# EAGLE design RadioMusic_F rev2-2 (EAGLE 9.0.1)
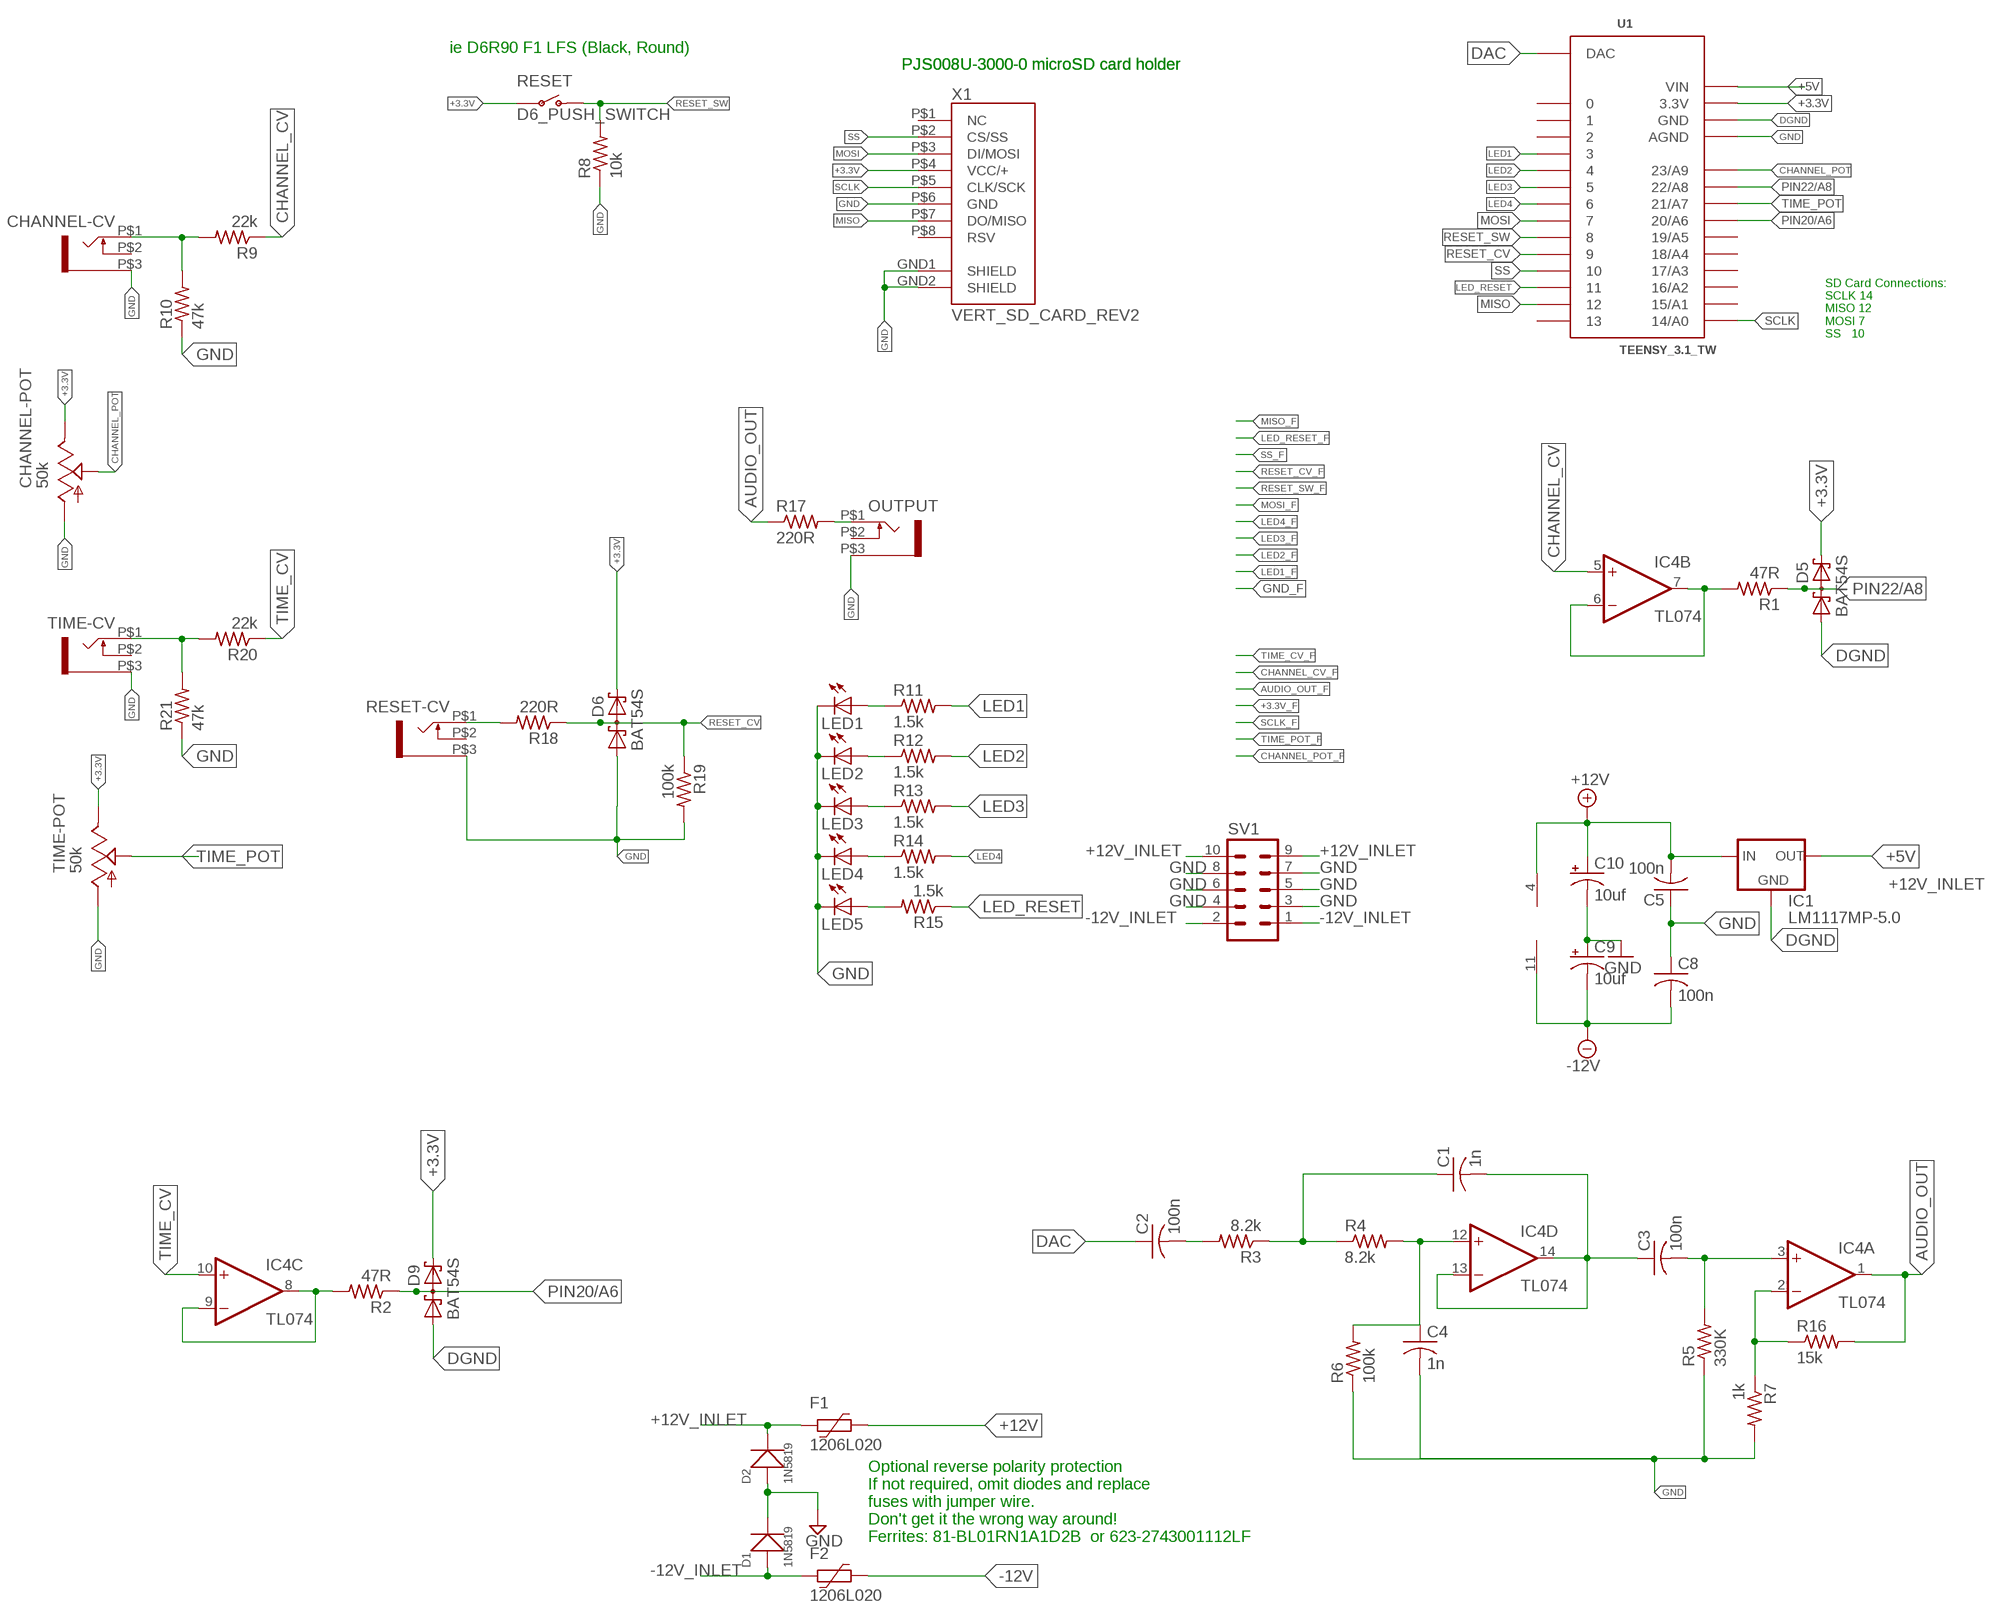
[diagram p0: schematic, sheet 1]

## Parts
C1  1n  C-USC0805  [C0805]
C2  100n  C-USC0805  [C0805]
C3  100n  C-USC0805  [C0805]
C4  1n  C-USC0805  [C0805]
C5  100n  C-USC0805  [C0805]
C8  100n  C-USC0805  [C0805]
C9  10uf  CPOL-USB  [PANASONIC_B]
C10  10uf  CPOL-USB  [PANASONIC_B]
CHANNEL-CV  WQP-PJ301M-12_JACK  [WQP-PJ301M-12_JACK]
CHANNEL-POT  50k  ALPHA-9MMF2A  [EVUF]
D1  1N5819  SMD-DIODE-SCHOTTKY-40V-500MA(SOD-123)  [SOD-123]
D2  1N5819  SMD-DIODE-SCHOTTKY-40V-500MA(SOD-123)  [SOD-123]
D5  BAT54S  [SOT23]
D6  BAT54S  [SOT23]
D9  BAT54S  [SOT23]
F1  1206L020  [1206L]
F2  1206L020  [1206L]
IC1  LM1117MP-5.0  [SOT223]
IC4  TL074  TL074D  [SO14]
LED1  LED3MM  [LED3MM]
LED2  LED3MM  [LED3MM]
LED3  LED3MM  [LED3MM]
LED4  LED3MM  [LED3MM]
LED5  LED3MM  [LED3MM]
OUTPUT  WQP-PJ301M-12_JACK  [WQP-PJ301M-12_JACK]
R1  47R  R-US_R0805  [R0805]
R2  47R  R-US_R0805  [R0805]
R3  8.2k  R-US_R0805  [R0805]
R4  8.2k  R-US_R0805  [R0805]
R5  330K  R-US_R0805  [R0805]
R6  100k  R-US_R0805  [R0805]
R7  1k  R-US_R0805  [R0805]
R8  10k  R-US_R0805  [R0805]
R9  22k  R-US_R0805  [R0805]
R10  47k  R-US_R0805  [R0805]
R11  1.5k  R-US_R0805  [R0805]
R12  1.5k  R-US_R0805  [R0805]
R13  1.5k  R-US_R0805  [R0805]
R14  1.5k  R-US_R0805  [R0805]
R15  1.5k  R-US_R0805  [R0805]
R16  15k  R-US_R0805  [R0805]
R17  220R  R-US_R0805  [R0805]
R18  220R  R-US_R0805  [R0805]
R19  100k  R-US_R0805  [R0805]
R20  22k  R-US_R0805  [R0805]
R21  47k  R-US_R0805  [R0805]
RESET  D6_PUSH_SWITCH  [D6_BUTTON_RND]
RESET-CV  WQP-PJ301M-12_JACK  [WQP-PJ301M-12_JACK]
SV1  10_PIN_HEADER  [MA05-2]
TIME-CV  WQP-PJ301M-12_JACK  [WQP-PJ301M-12_JACK]
TIME-POT  50k  ALPHA-9MMF2A  [EVUF]
U1  TEENSY_3.1_TW  [TEENSY_3.1_TW]
X1  VERT_SD_CARD_REV2  [VERT_MICROSD_REV2]

## Nets
+3.3V: CHANNEL-POT.3(E) D5.2(C2) D6.2(C2) D9.2(C2) RESET.P$3(P) RESET.P$4(P) TIME-POT.3(E) U1.3.3V X1.P$4(VCC/+)
+5V: IC1.2(OUT) IC1.4(OUT) U1.VIN
+12V [power]: C5.2 C10.+ F1.1 IC1.3(IN) IC4.4(P:V+)
+12V_INLET [power]: D2.- F1.2 SV1.9 SV1.10
-12V [power]: C8.2 C9.- F2.1 IC4.11(P:V-)
-12V_INLET [power]: D1.+ F2.2 SV1.1 SV1.2
AUDIO_OUT: IC4.1(A:OUT) R16.2 R17.1
CHANNEL_CV: IC4.5(B:+IN) R9.1
CHANNEL_POT: CHANNEL-POT.2(S) U1.23/A9
DAC: C2.1 U1.DAC
DGND: D5.1(A1) D9.1(A1) IC1.1(GND) U1.GND
GND [ground]: C4.2 C5.1 C8.1 C9.+ C10.- CHANNEL-CV.P$3 CHANNEL-POT.1(A) D1.- D2.+ D6.1(A1) LED1.K(C) LED2.K(C) LED3.K(C) LED4.K(C) LED5.K(C) OUTPUT.P$3 R5.1 R6.1 R7.2 R8.1 R10.1 R19.2 R21.1 RESET-CV.P$3 SV1.3 SV1.4 SV1.5 SV1.6 SV1.7 SV1.8 TIME-CV.P$3 TIME-POT.1(A) U1.AGND X1.GND1(SHIELD) X1.GND2(SHIELD) X1.P$6(GND)
LED1: R11.2 U1.3
LED2: R12.2 U1.4
LED3: R13.2 U1.5
LED4: R14.2 U1.6
LED_RESET: R15.1 U1.11
MISO: U1.12 X1.P$7(DO/MISO)
MOSI: U1.7 X1.P$3(DI/MOSI)
N$1: IC4.6(B:-IN) IC4.7(B:OUT) R1.2
N$2: C4.1 IC4.12(D:+IN) R4.2 R6.2
N$3: OUTPUT.P$1 R17.2
N$4: C1.1 R3.1 R4.1
N$5: C1.2 C3.1 IC4.13(D:-IN) IC4.14(D:OUT)
N$6: C3.2 IC4.3(A:+IN) R5.2
N$7: IC4.2(A:-IN) R7.1 R16.1
N$8: IC4.8(C:OUT) IC4.9(C:-IN) R2.2
N$9: CHANNEL-CV.P$1 R9.2 R10.2
N$10: C2.2 R3.2
N$11: LED2.A R12.1
N$12: LED4.A R14.1
N$13: LED3.A R13.1
N$14: R18.2 RESET-CV.P$1
N$15: LED1.A R11.1
N$16: LED5.A R15.2
PIN20/A6: D9.3(C1A2) R2.1 U1.20/A6
PIN22/A8: D5.3(C1A2) R1.1 U1.22/A8
RESET_CV: D6.3(C1A2) R18.1 R19.1 U1.9
RESET_SW: R8.2 RESET.P$1(O) RESET.P$2(O) U1.8
SCLK: U1.14/A0 X1.P$5(CLK/SCK)
SS: U1.10 X1.P$2(CS/SS)
TEMP: R20.2 R21.2 TIME-CV.P$1
TIME_CV: IC4.10(C:+IN) R20.1
TIME_POT: TIME-POT.2(S) U1.21/A7
Unconnected: CHANNEL-CV.P$2 OUTPUT.P$2 RESET-CV.P$2 TIME-CV.P$2 U1.0 U1.1 U1.2 U1.13 U1.15/A1 U1.16/A2 U1.17/A3 U1.18/A4 U1.19/A5 X1.P$1(NC) X1.P$8(RSV)

## Notes on the sheet
- ie D6R90 F1 LFS (Black, Round)
- PJS008U-3000-0 microSD card holder | PJS008U-3000-0 microSD card holder
- SD Card Connections: 
   SCLK 14
   MISO 12
   MOSI 7 
   SS   10
- Optional reverse polarity protection
  If not required, omit diodes and replace
  fuses with jumper wire. 
  Don't get it the wrong way around! 
  Ferrites: 81-BL01RN1A1D2B  or 623-2743001112LF

## Library data of the parts
C1-C5 C8 = rcl:C-US: CAPACITOR, American symbol; SPICEPREFIX: C
C9 C10 = resistor:CPOL-US: POLARIZED CAPACITOR, American symbol
CHANNEL-CV OUTPUT RESET-CV TIME-CV = thonkiconn:WQP-PJ301M-12_JACK
CHANNEL-POT TIME-POT = TomW:ALPHA-9MM: 9 mm Square Rotary Potentiometers Source: Panasonic
D1 D2 = Seeed-Diode:SMD-DIODE-SCHOTTKY-40V-500MA(SOD-123): 304020012; MPN: B0540W; VALUE: 40V-500MA
D5 D6 D9 = diode:BAT54S: Schottky Diodes Pin connection corrected 2011-05-04 Source: Fairchild .. BAT54.pdf
F1 F2 = polyfuse-smd_10:?: Polyfuse Resettable PTC Source: http://www.littelfuse.com/products/resettable-ptcs.aspx; MF: Littelfuse; MPN: 1206L020; OC_FARNELL: 2072173; OC_NEWARK: 05M2300
IC1 = lm1117:LM1117?-*: 800mA Low-Dropout Linear Regulator Source: http://ww1.microchip.com/downloads/en/DeviceDoc/39760d.pdf; MF: Texas Instruments; MPN: LM1117MP-5.0; OC_FARNELL: 9778209; OC_NEWARK: 28X3417
IC4 = linear:TL074: OP AMP
LED1-LED5 = TomW:LED: LED OSRAM: - CHIPLED LG R971, LG N971, LY N971, LG Q971, LY Q971, LO R971, LY R971 LH N974, LH R974 LS Q976, LO Q976, LY Q976 LO Q996 - Hyper CHIPLED LW Q18S LB Q993, LB Q99A, LB R99A - SideLED LS A670, LO A670, LY A670, LG A670, LP A670 LB A673, LV A673, LT A673, LW A673 LH A674 LY A675 LS A676, LA A676, LO A676, LY A676, LW A676 LS A679, LY A679, LG A679 - Hyper Micro SIDELED® LS Y876, LA Y876, LO Y876, LY Y876 LT Y87S - SmartLED LW L88C, LW L88S LB L89C, LB L89S, LG L890 LS L89K, LO L89K, LY L89K LS L896, LA L896, LO L896, LY L896 - TOPLED LS T670, LO T670, LY T670, LG T670, LP T670 LSG T670, LSP T670, LSY T670, LOP T670, LYG T670 LG T671, LOG T671, LSG T671 LB T673, LV T673, LT T673, LW T673 LH T674 LS T676, LA T676, LO T676, LY T676, LB T676, LH T676, LSB T676, LW T676 LB T67C, LV T67C, LT T67C, LS T67K, LO T67K, LY T67K, LW E67C LS E67B, LA E67B, LO E67B, LY E67B, LB E67C, LV E67C, LT E67C LW T67C LS T679, LY T679, LG T679 LS T770, LO T770, LY T770, LG T770, LP T770 LB T773, LV T773, LT T773, LW T773 LH T774 LS E675, LA E675, LY E675, LS T675 LS T776, LA T776, LO T776, LY T776, LB T776 LHGB T686 LT T68C, LB T68C - Hyper Mini TOPLED® LB M676 - Mini TOPLED Santana® LG M470 LS M47K, LO M47K, LY M47K Source: http://www.osram.convergy.de LUXEON: - LUMILED® LXK2-PW12-R00, LXK2-PW12-S00, LXK2-PW14-U00, LXK2-PW14-V00 LXK2-PM12-R00, LXK2-PM12-S00, LXK2-PM14-U00 LXK2-PE12-Q00, LXK2-PE12-R00, LXK2-PE12-S00, LXK2-PE14-T00, LXK2-PE14-U00 LXK2-PB12-K00, LXK2-PB12-L00, LXK2-PB12-M00, LXK2-PB14-N00, LXK2-PB14-P00, LXK2-PB14-Q00 LXK2-PR12-L00, LXK2-PR12-M00, LXK2-PR14-Q00, LXK2-PR14-R00 LXK2-PD12-Q00, LXK2-PD12-R00, LXK2-PD12-S00 LXK2-PH12-R00, LXK2-PH12-S00 LXK2-PL12-P00, LXK2-PL12-Q00, LXK2-PL12-R00 Source: www.luxeon.com KINGBRIGHT: KA-3528ASYC Source: www.kingbright.com
R1-R21 = rcl:R-US_: RESISTOR, American symbol; SPICEPREFIX: R
RESET = TomW:D6_PUSH_SWITCH
SV1 = TomW:10_PIN_HEADER: PIN HEADER; OC_FARNELL: unknown; OC_NEWARK: unknown
U1 = TomW:TEENSY_3.1_TW: Basic Teensy 3.0 with none of the 'inner' pins enabled. See '+4', 'AllAnalogPins", and 'AllPins' packages for additional pin holes, as needed.
X1 = TomW:VERT_SD_CARD_REV2

## Net classes
0 default: width 0.203 mm
1 power: width 0.305 mm
2 ground: width 0.305 mm

## Board
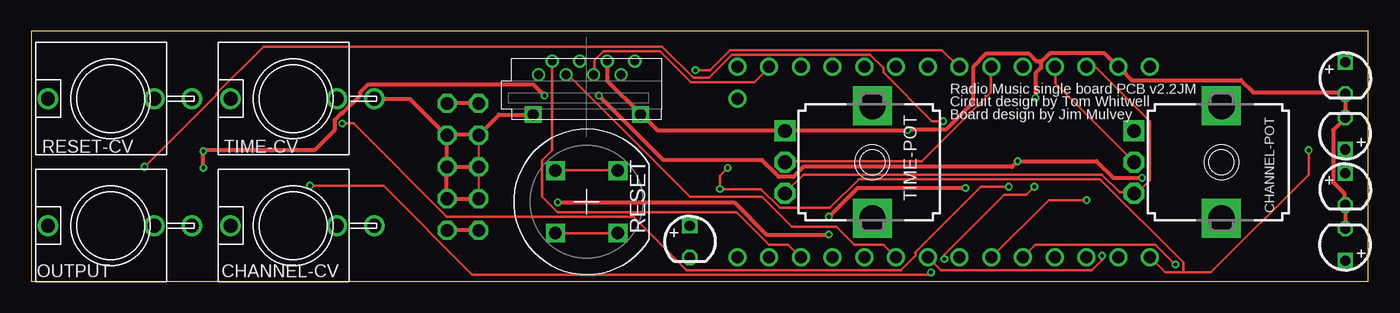
[diagram p1: board, top side]
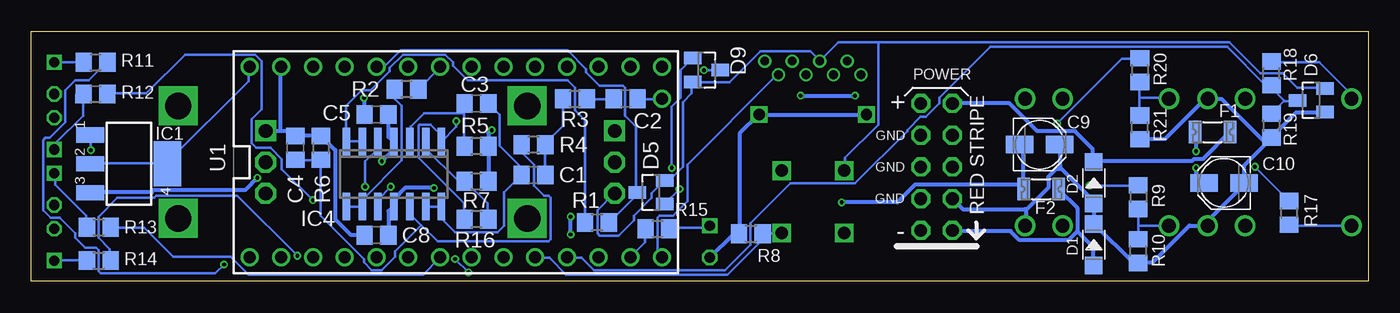
[diagram p2: board, bottom side, seen from below]

Size 107 x 20 mm. Coordinates in mm from the lower left corner, seen from the top.
Outline: 0,20 0,0 107,0 107,20 0,20
Copper layers (1*2*15*16): Top 0.035mm / dielectric 0.2mm / Route2 0.0175mm / dielectric 1.1mm / Route15 0.0175mm / dielectric 0.2mm / Bottom 0.035mm
Design rules "SeeedStudio_DRU_no_angle_20130527": minimum track width 6mil, minimum drill 12mil, track to track 6mil, track to pad 6mil, pad to pad 6mil, via to via 6mil, smd to smd 0mil, copper to edge 10mil, drill to drill 10mil, minimum pad ring 6mil, minimum via ring 6mil, stop-mask expansion 2mil, vias tented up to drill 25mil, thermal gap 10mil

### Footprints (pad centres in the part's own frame; a part is rotated, then mirrored left to right if it is on the bottom)
C0805 = smd 1.3 x 1.5: 1 -0.95,0; 2 0.95,0
PANASONIC_B = smd 2.2 x 1.4: + 1.6,0; - -1.6,0
WQP-PJ301M-12_JACK = drill 1.1: P$1 0,5; P$2 0,-3.5; P$3 0,-6.5
EVUF = drill 1.1 pad 1.676 square: 1 -2.5,-7 | drill 1.1 pad 1.676 octagon: 2 0,-7; 3 2.5,-7 | drill 2.1 pad 2.8 square: M1 4.5,0; M2 -4.5,0
SOD-123 = smd 1.397 x 1.397: + -1.651,0; - 1.651,0
SOT23 = smd 1 x 1.4: 1 -0.95,-1.1; 2 0.95,-1.1; 3 0,1.1
1206L = smd 1 x 1.8: 1 -1.4,0; 2 1.4,0
SOT223 = smd 1.219 x 2.235: 1 -2.311,-3.099; 2 0,-3.099; 3 2.311,-3.099 | smd 3.6 x 2.2: 4 0,3.099
SO14 = smd 0.6 x 2.2: 1 -3.81,-2.6; 2 -2.54,-2.6; 3 -1.27,-2.6; 4 0,-2.6; 5 1.27,-2.6; 6 2.54,-2.6; 7 3.81,-2.6; 8 3.81,2.6; 9 2.54,2.6; 10 1.27,2.6; 11 0,2.6; 12 -1.27,2.6; 13 -2.54,2.6; 14 -3.81,2.6
LED3MM = drill 0.813 square: A -1.27,0 | drill 0.813 octagon: K 1.27,0
R0805 = smd 1.3 x 1.5: 1 -0.95,0; 2 0.95,0
D6_BUTTON_RND = drill 1 square: P$1 -2.5,2.5; P$2 2.5,2.5; P$3 2.5,-2.5; P$4 -2.5,-2.5
MA05-2 = drill 1.016 octagon: 1 -5.08,-1.27; 2 -5.08,1.27; 3 -2.54,-1.27; 4 -2.54,1.27; 5 0,-1.27; 6 0,1.27; 7 2.54,-1.27; 8 2.54,1.27; 9 5.08,-1.27; 10 5.08,1.27
TEENSY_3.1_TW = drill 0.965: 0 -7.62,13.97; 1 -7.62,11.43; 2 -7.62,8.89; 3 -7.62,6.35; 3.3V 7.62,11.43; 4 -7.62,3.81; 5 -7.62,1.27; 6 -7.62,-1.27; 7 -7.62,-3.81; 8 -7.62,-6.35; 9 -7.62,-8.89; 10 -7.62,-11.43; 11 -7.62,-13.97; 12 -7.62,-16.51; 13 7.62,-16.51; 14/A0 7.62,-13.97; 15/A1 7.62,-11.43; 16/A2 7.62,-8.89; 17/A3 7.62,-6.35; 18/A4 7.62,-3.81; 19/A5 7.62,-1.27; 20/A6 7.62,1.27; 21/A7 7.62,3.81; 22/A8 7.62,6.35; 23/A9 7.62,8.89; AGND 7.62,13.97; DAC 5.08,-16.51; GND -7.62,16.51; VIN 7.62,16.51
VERT_MICROSD_REV2 = drill 0.9 square: GND1 -4.3,-3.17; GND2 4.3,-3.17 | drill 0.7: P$1 -3.85,0; P$2 -2.75,1.1; P$3 -1.65,0; P$4 -0.55,1.1; P$5 0.55,0; P$6 1.65,1.1; P$7 2.75,0; P$8 3.85,1.1

### Placement (x,y rotation side)
C1  66.8,8.51 180 bottom
C2  59.44,14.61 180 bottom
C3  71.37,14.22 180 bottom
C4  85.85,10.67 90 bottom
C5  79.38,13.34 0 bottom
C8  79.38,3.68 0 bottom
C9  26.29,10.92 0 bottom
C10  11.56,7.87 180 bottom
CHANNEL-CV  20.95,4.45 90 top
CHANNEL-POT  95.25,9.53 270 top
D1  21.97,2.92 90 bottom
D2  21.97,7.87 90 bottom
D5  57.4,7.11 90 bottom
D6  4.57,14.48 90 bottom
D9  52.96,16.89 270 bottom
F1  12.45,11.94 0 bottom
F2  26.16,7.37 0 bottom
IC1  99.19,9.4 270 bottom
IC4  77.98,8.58 180 bottom
LED1  105.16,16.26 270 top
LED2  105.16,11.81 90 top
LED3  105.16,7.37 270 top
LED4  105.16,2.92 90 top
LED5  52.7,3.17 270 top
OUTPUT  6.35,4.45 90 top
R1  61.72,4.7 180 bottom
R2  76.96,15.37 180 bottom
R3  63.5,14.61 0 bottom
R4  66.8,10.92 180 bottom
R5  71.37,10.79 180 bottom
R6  83.82,10.67 270 bottom
R7  71.37,8 0 bottom
R8  49.4,3.81 0 bottom
R9  18.41,6.73 270 bottom
R10  18.41,2.41 90 bottom
R11  101.85,17.53 0 bottom
R12  101.85,14.99 359.4 bottom
R13  101.6,4.32 0 bottom
R14  101.6,1.65 0 bottom
R15  56.9,4.19 0 bottom
R16  71.37,4.95 180 bottom
R17  6.35,5.46 270 bottom
R18  7.75,16.64 90 bottom
R19  7.75,12.45 270 bottom
R20  18.29,16.89 270 bottom
R21  18.29,12.32 90 bottom
RESET  44.45,6.35 180 top
RESET-CV  6.35,14.61 90 top
SV1  34.54,9.14 90 bottom
TIME-CV  20.95,14.61 90 top
TIME-POT  67.31,9.53 270 top
U1  73.03,9.53 90 bottom
X1  44.45,16.51 0 top

### Tracks (layer width: path | path; a pad name or v marks a point on that pad's centre or on a via)
+3.3V
  Top 0.203: U1.3.3V 84.45,17.07 85.25,17.07 89.52,12.8 89.52,8.09 88.54,7.11 88.28,7.11 CHANNEL-POT.3 88.19,7.11 87.12,7.11 85.7,8.53 61.78,8.53 60.36,7.11 TIME-POT.3 | RESET.P$3 41.96,8.89 46.94,8.89 RESET.P$4
  Bottom 0.203: TIME-POT.3 60.36,7.02 61.7,5.69 61.7,3.82 61.52,3.65 60.01,3.65 58.76,4.89 58.76,5.25 57.34,6.67 57.34,7.02 56.36,8 D5.2 56.27,8.09 55.92,8.09 54.85,9.16 54.85,14.31 54.14,15.02 54.14,15.91 D9.2 53.96,15.91 51.12,15.91 48.63,18.4 44.63,18.4 43.92,17.69 X1.P$4 43.83,17.69 42.41,19.11 39.2,19.11 | 39.2,19.11 11.11,19.11 8.62,16.62 6.84,16.62 5.69,15.47 3.56,15.47 D6.2 | 39.2,19.11 39.2,12.54 41.87,9.87 41.87,8.89 RESET.P$3
+5V
  Bottom 0.203: IC1.2 102.23,9.42 96.1,9.42 IC1.4 96.1,9.51 89.61,16 89.61,17.07 U1.VIN
+12V  (via drill 0.3)
  Top 0.305: v13.78,9.07 v13.78,10.4 13.87,10.49 22.67,10.49 24.27,12.09 24.27,12.89 24.8,13.42 24.89,13.42 26.31,14.85 26.31,15.11 26.94,15.73 40.18,15.73 v41.07,14.85 | v88.9,8.27 86.59,8.27 85.25,9.6 v78.94,9.6 78.5,9.16 61.78,9.16 60.98,8.36 59.83,8.36 58.5,9.69 50.58,9.69 v45.43,14.85
  Bottom 0.305: v13.78,10.4 13.78,11.91 F1.1 | v13.78,9.07 13.78,8.53 13.16,7.91 C10.+ | C5.2 78.41,11.56 78.05,11.2 IC4.4 77.97,11.02 77.97,10.58 v78.94,9.6 | v88.9,8.27 89.88,7.29 97.17,7.29 97.35,7.11 102.23,7.11 IC1.3 | v45.43,14.85 v41.07,14.85
+12V_INLET
  Top 0.305: SV1.10 SV1.9
  Bottom 0.305: F1.2 11.11,11.91 13.25,9.78 13.96,9.78 14.13,9.6 21.96,9.6 D2.- 22.05,9.69 22.05,10.58 23.47,12 26.49,12 28.71,14.22 SV1.9
-12V  (via drill 0.3)
  Top 0.305: v74.77,7.47 66.14,7.47 v63.83,5.16 | v63.83,3.73 58.85,3.73 56.27,6.31 v42.14,6.31
  Bottom 0.305: C8.2 78.41,3.73 78.41,5.6 78.05,5.96 IC4.11 77.97,6.13 77.97,6.58 77.08,7.47 v74.77,7.47 | C9.- 27.83,10.85 27.65,10.67 27.65,7.38 F2.1 27.74,7.73 36.27,7.73 37.69,6.31 v42.14,6.31 | v63.83,3.73 v63.83,5.16
-12V_INLET
  Top 0.305: SV1.1 33.34,4.09 35.74,4.09 SV1.2
  Bottom 0.305: 23.29,4 22.05,2.76 22.05,1.33 D1.+ | 23.29,4 23.29,5.87 24.71,7.29 F2.2 | 23.29,4 24,3.29 27.91,3.29 28.63,4 33.25,4 SV1.1
AUDIO_OUT  (via drill 0.3)
  Top 0.203: v9.07,9.16 14.85,14.94 14.85,15.02 18.58,18.76 50.49,18.76 52.98,16.27 54.23,16.27 56.1,18.14 67.12,18.14 68.19,17.07 68.19,16.71 72.1,12.8 v72.99,12.8
  Bottom 0.203: v9.07,9.16 6.4,6.49 R17.1 | v72.99,12.8 72.99,12.36 IC4.1 73.97,11.47 75.03,12.54 75.92,12.54 76.01,12.45 76.01,9.87 72.36,6.22 72.36,4.98 R16.2
CHANNEL_CV  (via drill 0.3)
  Top 0.203: v22.31,7.64 28.18,7.64 35.29,0.53 71.83,0.53 v72.01,0.71 | v73.08,1.78 73.08,2.13 77.88,6.93 79.65,6.93 v80.28,7.56
  Bottom 0.203: v22.31,7.64 18.49,7.64 R9.1 | v73.08,1.78 v72.01,0.71 | v80.28,7.56 80.28,9.6 79.3,10.58 79.3,11.11 IC4.5
CHANNEL_POT
  Top 0.203: U1.23/A9 81.97,17.07 81.97,15.82 88.19,9.6 CHANNEL-POT.2
DAC
  Bottom 0.203: C2.1 58.41,14.58 56.54,14.58 U1.DAC
DGND  (via drill 0.3)
  Top 0.203: v55.74,9.07 55.12,8.45 v55.12,7.38 58.41,7.38 59.92,5.87 63.92,5.87 66.23,8.18 85.52,8.18 92.19,1.51 92.19,0.71 | v102.23,10.49 102.23,8.53 94.41,0.71 92.19,0.71 | 92.19,0.71 90.77,0.71 89.61,1.87 U1.GND
  Bottom 0.203: v55.12,7.38 56.27,6.22 D5.1 | v55.74,9.07 55.74,13.96 55.03,14.67 55.03,16.89 54.14,17.78 D9.1 | v102.23,10.49 102.23,11.65 IC1.1
GND  (via drill 0.3)
  Top 0.152: SV1.8 35.81,6.66 35.74,6.58
  Top 0.305: SV1.4 35.74,6.58 33.34,6.58 SV1.3 33.25,6.76 33.25,9.07 SV1.5 | SV1.6 35.74,9.16 33.43,9.16 SV1.5 | X1.GND1 40.09,13.34 37.43,13.34 35.83,11.73 SV1.8 35.74,11.73 33.34,11.73 SV1.7 | TIME-CV.P$3 27.47,14.58 30.32,14.58 33.16,11.73 SV1.7 | SV1.5 33.25,9.25 33.25,11.56 SV1.7 | LED4.K 105.17,4.27 105.17,6.04 LED3.K 105.08,6.22 105.08,7.02 104.19,7.91 104.19,12.09 105.08,12.98 LED2.K 105.17,13.16 105.17,14.94 LED1.K 105.08,15.11 97.79,15.11 96.81,16.09 88.1,16.09 87.12,17.07 U1.AGND 86.94,17.16 85.88,18.22 81.52,18.22 80.81,17.51 | v80.37,14.67 80.37,16.62 80.81,17.07 80.81,17.51 | X1.P$6 46.14,17.6 46.14,16 48.72,13.42 X1.GND2 48.9,13.34 50.14,12.09 60.19,12.09 TIME-POT.1 60.36,12.09 v70.14,12.09 70.23,12.18 73.25,12.18 75.39,14.31 75.39,17.16 76.45,18.22 79.83,18.22 80.45,17.6 80.72,17.6 80.81,17.51
  Bottom 0.305: R21.1 18.22,11.38 16.27,11.38 13.07,14.58 12.89,14.58 RESET-CV.P$3 12.71,14.58 11.73,14.58 8.27,11.11 R19.2 | D6.1 3.56,13.51 5.78,13.51 7.73,11.56 R19.2 | R19.2 7.82,11.38 9.96,9.25 9.96,7.91 C10.- 9.96,7.73 12.8,4.89 12.8,4.45 OUTPUT.P$3 14.31,4.45 17.25,1.51 18.31,1.51 R10.1 18.49,1.51 18.85,1.51 21.87,4.53 D1.- 21.96,4.62 21.96,6.22 D2.+ 21.87,6.31 24.62,9.07 | 24.62,9.07 24.62,10.85 C9.+ | 27.38,5.69 27.38,4.45 CHANNEL-CV.P$3 | 27.38,5.69 25.6,7.47 25.6,8.36 24.98,8.98 24.71,8.98 24.62,9.07 | SV1.3 32.45,5.78 27.47,5.78 27.38,5.69 | v80.37,14.67 80.37,13.34 C5.1 | C8.1 80.37,3.73 81.43,3.73 82.68,4.98 82.68,10.49 83.74,11.56 R6.1 83.92,11.65 85.79,11.65 C4.2 85.97,11.65 86.32,12 87.03,12 | 87.03,12 88.19,12 CHANNEL-POT.1 | 87.03,12 87.03,17.07 U1.AGND | R7.2 70.41,10.76 R5.1 70.41,10.94 70.41,11.82 v70.14,12.09 | LED5.K 52.63,1.96 50.85,3.73 50.41,3.73 R8.1 50.32,3.91 50.32,11.82 48.81,13.34 X1.GND2 48.63,13.34 40.18,13.34 X1.GND1
LED1  (via drill 0.3)
  Top 0.203: v91.57,1.33 89.97,2.93 80.37,2.93 79.39,1.96 U1.3
  Bottom 0.203: v91.57,1.33 92.28,0.62 101.44,0.62 101.61,0.8 101.61,2.49 101.79,2.67 102.68,2.67 103.48,3.47 103.48,3.82 104.72,5.07 105.44,5.07 106.06,5.69 106.06,11.29 105.88,11.47 105.52,11.47 104.28,12.71 104.28,15.29 103.48,16.09 102.41,16.09 100.99,17.51 R11.2
LED2  (via drill 0.3)
  Top 0.203: v84.45,6.49 81.43,6.49 76.9,1.96 U1.4
  Bottom 0.203: v84.45,6.49 86.94,8.98 86.94,9.78 87.83,10.67 88.99,10.67 89.34,11.02 89.34,12.98 88.54,13.78 88.54,17.6 89.08,18.14 94.68,18.14 97.79,15.02 100.9,15.02 R12.2
LED3
  Bottom 0.203: R13.2 100.64,4.27 97.97,4.27 95.66,1.96 91.03,1.96 89.61,0.53 75.65,0.53 74.32,1.87 U1.5
LED4  (via drill 0.3)
  Top 0.203: v85.7,2.04 85.7,1.69 84.9,0.89 72.81,0.89 71.83,1.87 U1.6
  Bottom 0.203: v85.7,2.04 90.5,6.84 96.99,6.84 97.17,6.67 100.1,6.67 101.61,5.16 101.61,3.47 100.72,2.58 100.72,1.69 R14.2
LED_RESET
  Bottom 0.203: R15.1 57.87,4.18 57.87,3.11 59.03,1.96 U1.11
MISO
  Bottom 0.203: X1.P$7 47.21,16.45 47.38,16.45 54.5,9.34 54.5,6.4 55.65,5.25 56.72,5.25 56.9,5.07 56.9,2.31 56.54,1.96 U1.12
MOSI
  Top 0.203: U1.7 68.19,2.93 65.88,2.93 64.45,4.36 60.9,4.36 58.5,6.76 52.72,6.76 43.03,16.45 42.85,16.45 X1.P$3
N$1
  Bottom 0.203: R1.2 62.67,4.71 62.67,12.89 63.48,13.69 63.48,15.47 64.1,16.09 72.1,16.09 73.25,17.25 73.25,17.51 73.88,18.14 77.25,18.14 78.32,17.07 78.32,16.8 79.83,15.29 80.54,15.29 81.79,14.05 IC4.7 81.7,11.2 80.54,11.2 IC4.6
N$2
  Bottom 0.203: C4.1 85.79,9.69 83.83,9.69 R6.2 83.83,9.6 83.83,5.25 80.37,1.78 80.37,1.51 79.74,0.89 78.94,0.89 77.88,1.96 77.88,2.4 75.79,4.49 | 75.79,4.49 76.63,5.33 76.63,5.96 IC4.12 | 75.79,4.49 74.5,3.2 65.61,3.2 65.43,3.38 65.43,6.67 65.61,6.84 65.96,6.84 66.76,7.64 66.76,9.34 67.74,10.31 67.74,10.85 R4.2
N$3
  Bottom 0.203: OUTPUT.P$1 6.31,4.45 R17.2
N$4
  Bottom 0.203: C1.1 65.88,8.53 65.88,10.85 R4.1 65.88,11.02 64.45,12.45 64.45,14.58 R3.1
N$5
  Bottom 0.203: IC4.13 75.39,5.96 74.23,5.96 IC4.14 74.23,5.87 74.23,5.07 73.08,3.91 69.7,3.91 69.16,4.45 69.16,7.11 67.83,8.45 C1.2 67.83,8.53 67.83,9.16 69.52,10.85 69.52,13.34 C3.1
N$6
  Bottom 0.203: 72.36,13.42 72.36,14.22 C3.2 | 72.36,13.42 72.36,10.85 R5.2 | 72.36,13.42 75.56,13.42 76.63,12.36 76.63,11.2 IC4.3
N$7
  Bottom 0.203: R16.1 70.5,4.98 70.5,6.22 72.28,8 R7.1 72.36,8.09 72.9,8.09 75.39,10.58 75.39,11.11 IC4.2
N$8
  Bottom 0.203: R2.2 77.88,15.29 77.88,14.58 77.34,14.05 77.34,9.69 80.45,6.58 80.45,6.04 IC4.9 80.54,5.96 81.79,5.96 IC4.8
N$9
  Bottom 0.203: 18.4,4.45 R9.2 | 18.4,4.45 18.4,3.38 R10.2 | CHANNEL-CV.P$1 18.4,4.45
N$10
  Bottom 0.203: C2.2 60.45,14.58 62.5,14.58 R3.2
N$11
  Bottom 0.203: R12.1 102.86,14.94 102.86,13.25 105.08,11.02 105.08,10.58 LED2.A
N$12
  Bottom 0.203: R14.1 102.59,1.69 105.08,1.69 LED4.A
N$13
  Bottom 0.203: R13.1 102.59,4.36 102.59,5.25 105.08,7.73 105.08,8.62 LED3.A
N$14
  Bottom 0.203: R18.2 7.73,17.51 3.91,17.51 1.42,15.02 1.42,14.67 RESET-CV.P$1
N$15
  Bottom 0.203: R11.1 102.86,17.51 105.08,17.51 LED1.A
N$16
  Bottom 0.203: R15.2 55.92,4.27 52.9,4.27 52.72,4.45 LED5.A
PIN20/A6  (via drill 0.3)
  Top 0.203: v53.16,16.89 54.32,16.89 55.92,18.49 72.9,18.49 74.23,17.16 U1.20/A6
  Bottom 0.203: v53.16,16.89 D9.3 | R2.1 74.32,17.07 U1.20/A6
PIN22/A8
  Bottom 0.203: R1.1 60.72,4.71 58.59,6.84 58.59,7.11 D5.3 58.59,7.2 58.59,12.36 59.47,13.25 59.47,15.47 59.65,15.65 61.52,15.65 62.59,16.71 62.59,16.98 64.1,18.49 77.43,18.49 78.77,17.16 79.3,17.16 U1.22/A8
RESET_CV
  Bottom 0.203: 6.76,14.4 5.69,14.4 D6.3 | 6.76,14.4 7.73,13.42 R19.1 | 6.76,14.4 6.76,14.49 7.73,15.47 7.73,15.65 R18.1 7.82,15.73 8.27,15.73 11.29,18.76 30.23,18.76 34.31,14.67 34.31,14.22 35.38,13.16 35.83,13.16 36.89,12.09 36.89,12 41.07,7.82 46.23,7.82 49.43,4.62 49.43,2.93 51.47,0.89 61.96,0.89 62.94,1.87 64.1,1.87 U1.9
RESET_SW
  Top 0.203: RESET.P$2 41.96,3.82 46.94,3.82 RESET.P$1
  Bottom 0.203: RESET.P$1 47.03,3.82 48.45,3.82 R8.2 48.54,3.73 48.54,3.29 51.3,0.53 64.19,0.53 65.52,1.87 66.67,1.87 U1.8
SCLK
  Top 0.203: X1.P$5 45.07,16.54 45.07,17.69 45.78,18.4 50.32,18.4 52.81,15.91 57.87,15.91 59.03,17.07 U1.14/A0
SS
  Top 0.203: X1.P$2 41.69,10.49 40.89,9.69 40.89,6.76 42.14,5.51 56.45,5.51 59.03,2.93 60.54,2.93 61.52,1.96 U1.10
TEMP
  Bottom 0.203: 18.31,14.67 18.31,15.91 R20.2 | 18.31,14.67 18.31,13.34 R21.2 | 18.31,14.67 16,14.67 TIME-CV.P$1
TIME_CV  (via drill 0.3)
  Top 0.203: v24.89,12.62 25.78,12.62 33.25,5.16 48.18,5.16 52.45,0.89 69.61,0.89 70.76,2.04 70.76,2.31 76.01,7.56 v78.23,7.56
  Bottom 0.203: v24.89,12.62 19.74,17.78 18.31,17.78 R20.1 | v78.23,7.56 79.21,6.58 79.21,6.04 IC4.10
TIME_POT
  Top 0.203: U1.21/A7 76.81,17.07 76.81,15.11 71.3,9.6 60.36,9.6 TIME-POT.2

### Text on the board
tPlace: Radio Music single board PCB v2.2JM / Circuit design by Tom Whitwell / Board design by Jim Mulvey